# Altium schematic sheet Allimentations.SchDoc
size A3; Organization: ETML-ES; Address1: Avenue Recordon 1; Address2: 1004 Lausanne; Address3: Switzerland; SheetNumber: 2; SheetTotal: 2; SPICEModelCacheEALWWPYI: <root> / <DocumentId>EALWWPYI</DocumentId> / <CacheFrame Number="0"> / <Model Name="fuse" Kind="CKT"> / <Text>.SUBCKT FUSE 1 2 PARAMS: CURRENT=1 RESISTANCE=1m / SW1 1 2 3 0 SMOD OFF / BNLV 3 0 V=(abs(v(1,2))) / .MODEL SMOD SW (VT={(CURRENT*RESISTANCE)} RON=1g ROFF={RESISTANCE}) / .ENDS FUSE</Text> / </Model> / </CacheFrame> / </root>
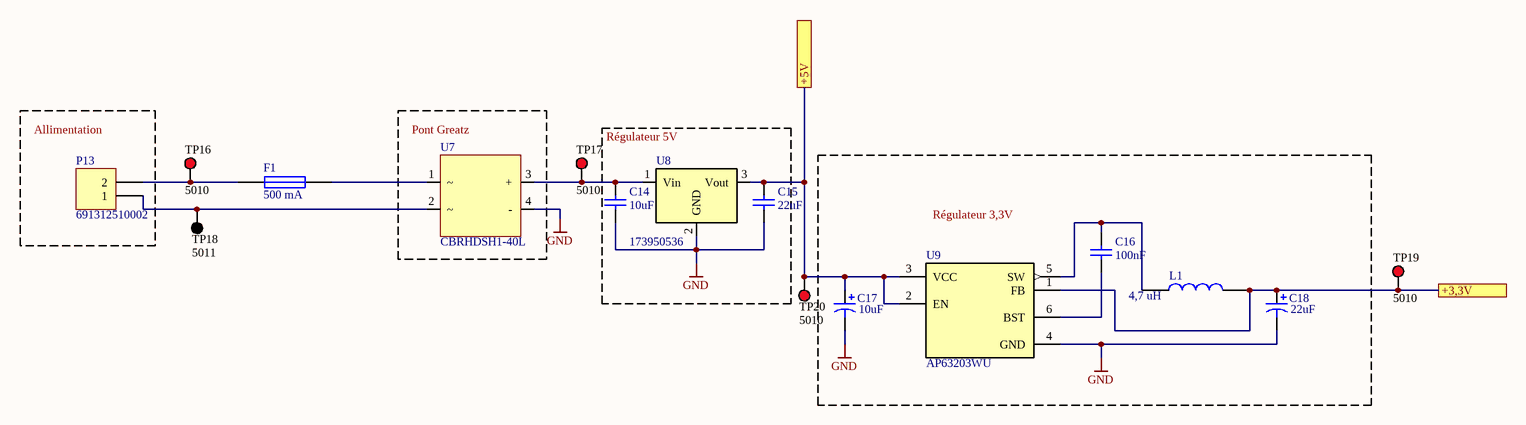
[diagram p0: Allimentations.SchDoc]

## Parts
C14  value 10uF  [C0805]  (hidden comment: Cap)
C15  value 22uF  [C0805]  (hidden comment: Cap)
C16  value 100nF  [C0805]  (hidden comment: Cap)
C17  value 10uF  [CAP_EEEFK1E331GP]  (hidden comment: Cap Pol1)
C18  value 22uF  [CAP_EEEFK1E331GP]  (hidden comment: Cap Pol1)
F1  500 mA  [PIN-W2/E2.8]
L1  4,7 uH  [CDRH125101MC]
P13  691312510002  [691312710002]
TP16  5010  [KSTN-5010_V]
TP17  5010  [KSTN-5010_V]
TP18  5011  [KSTN-5011_V]
TP19  5010  [KSTN-5010_V]
TP20  5010  [KSTN-5010_V]
U7  CBRHDSH1-40L  [CBRHDSH1-40L]
U8  173950536  [173950536]
U9  AP63203WU  [AP63203WU]

## Blocks framed on the sheet
Allimentation: P13
Pont Greatz: U7
Régulateur 5V: C14 C15 U8

## Ports
+3,3V, +5V

## Nets
GND: C14.1 C15.1 C17.2 C18.2 U7.4(-) U8.2(GND) U9.4(GND)
+3,3V: C18.1 L1.2 TP19.1 U9.1(FB) ; port +3,3V
+5V: C15.2 C17.1 TP20.1 U8.3(Vout) U9.2(EN) U9.3(VCC) ; port +5V
NetC14_2: C14.2 TP17.1 U7.3(+) U8.1(Vin)
NetC16_1: C16.1 U9.6(BST)
NetC16_2: C16.2 L1.1 U9.5(SW)
NetF1_1: F1.1 P13.2 TP16.1
NetF1_2: F1.2 U7.1
NetP13_1: P13.1 TP18.1 U7.2

## Notes on the sheet
- Régulateur 3,3V
- Fichier :
- a
- Date :
- Heure :
- Version :
- Auteur :
- Modif.
- b
- c
- d
- Projet :
- No :
- Nb feuilles
- Feuille n°
- Chemin :

## Library data of the parts
C14-C16 = Cap: Capacitor; Published: 8-Jun-2000; LatestRevisionDate: 17-Jul-2002; LatestRevisionNote: Re-released for DXP Platform.; PackageReference: RAD-0.3; Publisher: Altium Limited; PackageDescription: Radial Cap, Thru-Hole; 2 Leads; 0.3 in Pin Spacing
C17 C18 = Cap Pol1: Polarized Capacitor (Radial); Published: 8-Jun-2000; LatestRevisionDate: 17-Jul-2002; LatestRevisionNote: Re-released for DXP Platform.; PackageReference: RB7.6-15; Publisher: Altium Limited; PackageDescription: Polarized Capacitor (Radial); 2 Leads
F1 = Fuse 1: Fuse; Published: 8-Jun-2000; LatestRevisionDate: 17-Jul-2002; LatestRevisionNote: Re-released for DXP Platform.; PackageReference: PIN-W2/E2.8; Publisher: Altium Limited; PackageDescription: Thru-Hole; 2 Leads
L1 = CDRH125NP-220MC: Fixed Inductors 22uH 2.80A 0.028ohms; Manufacturer_Name: Sumida; Geometry.Height: 6mm; Future Part Number: *; Future Price/Stock: *; Manufacturer_Part_Number: CDRH125NP-220MC; Datasheet Link: http://products.sumida.com/products/pdf/CDRH125,CDRH125LD.pdf
P13 = MHDR1X2: Header, 2-Pin; LatestRevisionDate: 17-Jul-2002; LatestRevisionNote: Re-released for DXP Platform.; Publisher: Altium Limited
TP16 TP17 TP19 TP20 = CMP-1672-00002-4: Test Point, Red, Through Hole, RoHS, Bulk; Manufacturer: Keystone; Contact Material: Bronze; Mounting Technology: Through Hole; RoHSCompliant: true; Pins: 1; Package Quantity: 100; ComponentLink2Description: Datasheet; Height: 8.12 mm; ComponentLink1URL: http://www.keyelco.com/; DatasheetVersion: Rev. F, 12/2013; Mount: Through Hole; PackageReference: 5010; Contact Plating: Silver; Packaging: Bulk; Colour: Red; REACH SVHC: No SVHC; PackageDescription: 1-Pin Through Hole Device, Dia 3.17 mm; ComponentLink2URL: http://www.keyelco.com/product-pdf.cfm?p=1319; ComponentLink1Description: Manufacturer URL
TP18 = CMP-1672-00003-4: Test Point, Black, Through Hole, RoHS, Bulk; Manufacturer: Keystone; ComponentLink2URL: http://www.keyelco.com/product-pdf.cfm?p=1320; Colour: Black; Pins: 1; REACH SVHC: No SVHC; ComponentLink1URL: http://www.keyelco.com/; PackageReference: 5011; Contact Plating: Silver; Package Quantity: 100; Packaging: Bulk; RoHSCompliant: true; Height: 8.12 mm; PackageDescription: 1-Pin Through Hole Device, Dia 3.17 mm; Mount: Through Hole; Mounting Technology: Through Hole; DatasheetVersion: Rev. F, 12/2013; ComponentLink1Description: Manufacturer URL; Contact Material: Bronze; ComponentLink2Description: Datasheet